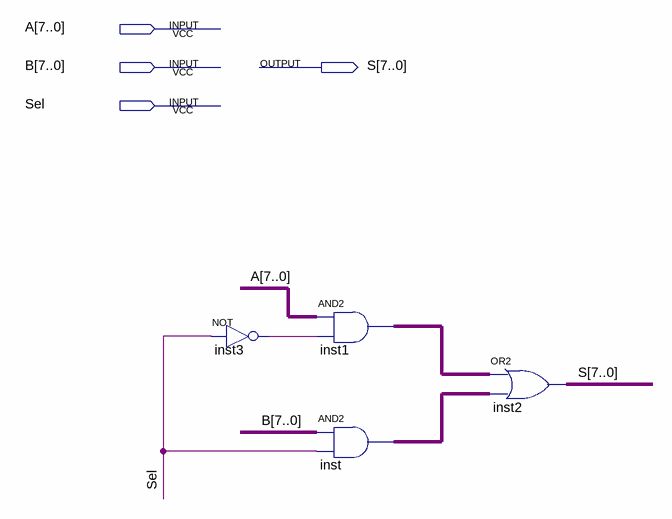
[diagram p0: schematic sheet]
// Quartus schematic MUX218b.bdf as structural Verilog: 4 symbols, 4 pins
module MUX218b (
  input  [7:0] A,
  input  [7:0] B,
  input  Sel,
  output [7:0] S
);

  wire inst3_out;
  wire [7:0] inst1_out, inst_out;

  not inst3 (inst3_out, Sel);
  assign inst1_out = A & {8{inst3_out}};  // AND2 inst1, 8 bits wide
  assign inst_out = B & {8{Sel}};  // AND2 inst, 8 bits wide
  assign S = inst1_out | inst_out;  // OR2 inst2, 8 bits wide
endmodule
